# EAGLE design TestBoard1 (EAGLE 7.1.0)
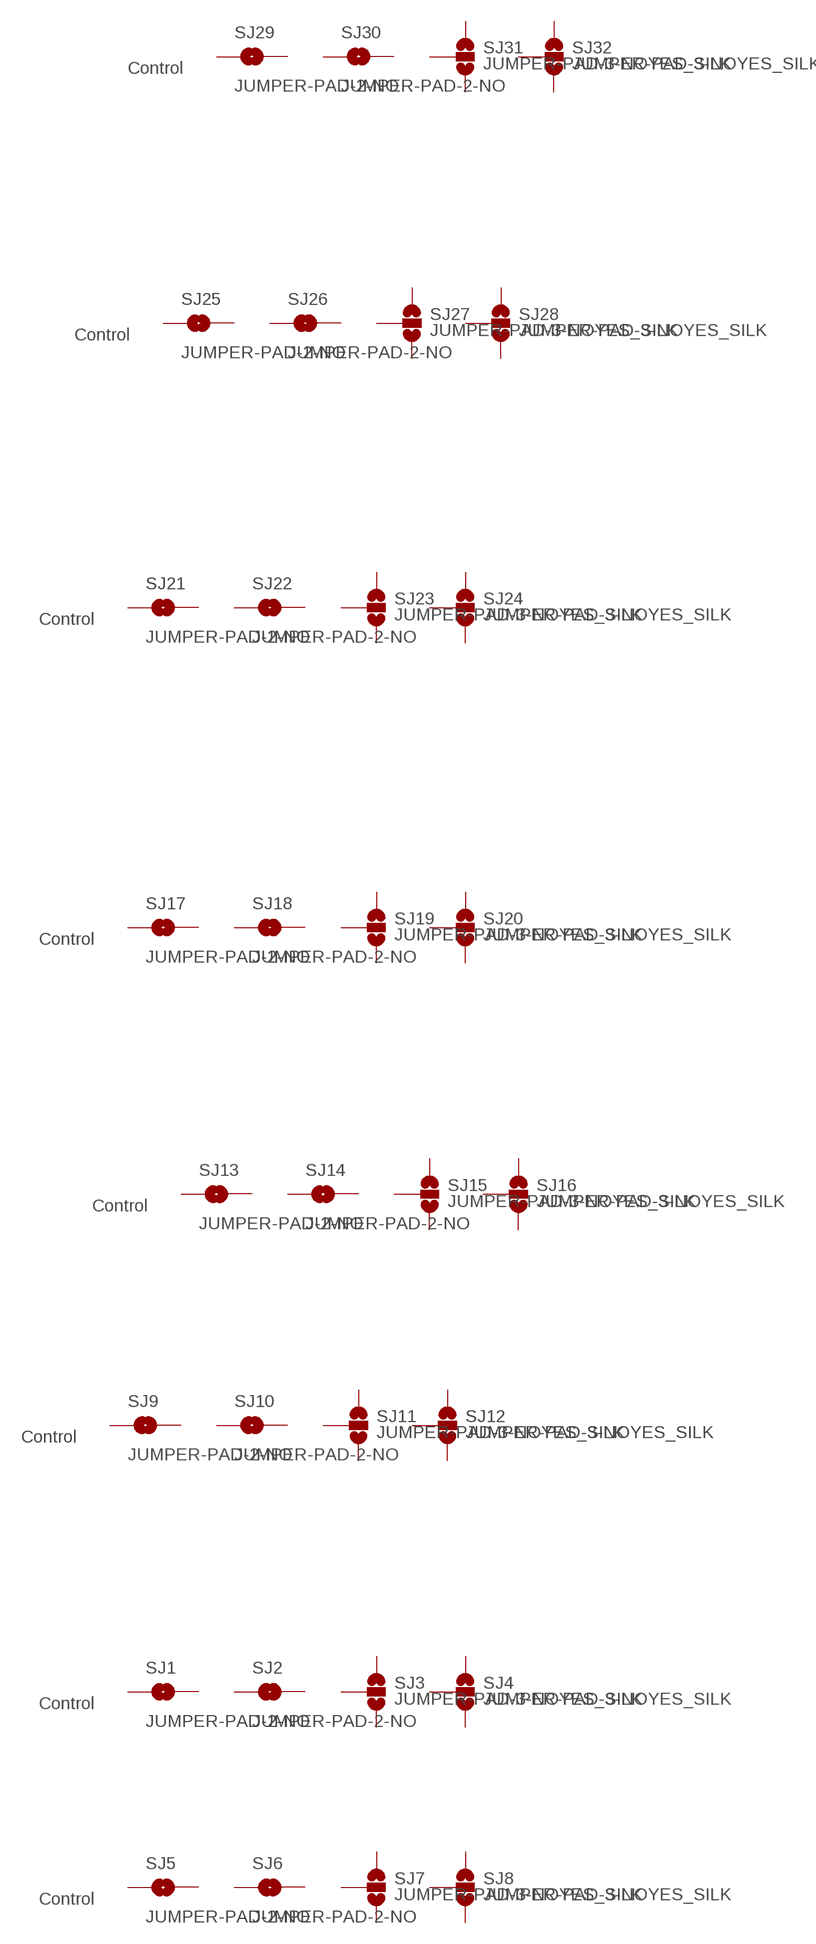
[diagram p0: schematic, sheet 1]

## Parts
SJ1  JUMPER-PAD-2-NO  [PAD-JUMPER-2-NO_NO_SILK]
SJ2  JUMPER-PAD-2-NO  [PAD-JUMPER-2-NO_NO_SILK]
SJ3  JUMPER-PAD-3-NOYES_SILK  [PAD-JUMPER-3-NO_YES_SILK]
SJ4  JUMPER-PAD-3-NOYES_SILK  [PAD-JUMPER-3-NO_YES_SILK]
SJ5  JUMPER-PAD-2-NO  [PAD-JUMPER-2-NO_NO_SILK]
SJ6  JUMPER-PAD-2-NO  [PAD-JUMPER-2-NO_NO_SILK]
SJ7  JUMPER-PAD-3-NOYES_SILK  [PAD-JUMPER-3-NO_YES_SILK]
SJ8  JUMPER-PAD-3-NOYES_SILK  [PAD-JUMPER-3-NO_YES_SILK]
SJ9  JUMPER-PAD-2-NO  [PAD-JUMPER-2-NO_NO_SILK]
SJ10  JUMPER-PAD-2-NO  [PAD-JUMPER-2-NO_NO_SILK]
SJ11  JUMPER-PAD-3-NOYES_SILK  [PAD-JUMPER-3-NO_YES_SILK]
SJ12  JUMPER-PAD-3-NOYES_SILK  [PAD-JUMPER-3-NO_YES_SILK]
SJ13  JUMPER-PAD-2-NO  [PAD-JUMPER-2-NO_NO_SILK]
SJ14  JUMPER-PAD-2-NO  [PAD-JUMPER-2-NO_NO_SILK]
SJ15  JUMPER-PAD-3-NOYES_SILK  [PAD-JUMPER-3-NO_YES_SILK]
SJ16  JUMPER-PAD-3-NOYES_SILK  [PAD-JUMPER-3-NO_YES_SILK]
SJ17  JUMPER-PAD-2-NO  [PAD-JUMPER-2-NO_NO_SILK]
SJ18  JUMPER-PAD-2-NO  [PAD-JUMPER-2-NO_NO_SILK]
SJ19  JUMPER-PAD-3-NOYES_SILK  [PAD-JUMPER-3-NO_YES_SILK]
SJ20  JUMPER-PAD-3-NOYES_SILK  [PAD-JUMPER-3-NO_YES_SILK]
SJ21  JUMPER-PAD-2-NO  [PAD-JUMPER-2-NO_NO_SILK]
SJ22  JUMPER-PAD-2-NO  [PAD-JUMPER-2-NO_NO_SILK]
SJ23  JUMPER-PAD-3-NOYES_SILK  [PAD-JUMPER-3-NO_YES_SILK]
SJ24  JUMPER-PAD-3-NOYES_SILK  [PAD-JUMPER-3-NO_YES_SILK]
SJ25  JUMPER-PAD-2-NO  [PAD-JUMPER-2-NO_NO_SILK]
SJ26  JUMPER-PAD-2-NO  [PAD-JUMPER-2-NO_NO_SILK]
SJ27  JUMPER-PAD-3-NOYES_SILK  [PAD-JUMPER-3-NO_YES_SILK]
SJ28  JUMPER-PAD-3-NOYES_SILK  [PAD-JUMPER-3-NO_YES_SILK]
SJ29  JUMPER-PAD-2-NO  [PAD-JUMPER-2-NO_NO_SILK]
SJ30  JUMPER-PAD-2-NO  [PAD-JUMPER-2-NO_NO_SILK]
SJ31  JUMPER-PAD-3-NOYES_SILK  [PAD-JUMPER-3-NO_YES_SILK]
SJ32  JUMPER-PAD-3-NOYES_SILK  [PAD-JUMPER-3-NO_YES_SILK]
Unconnected: SJ1.1 SJ1.2 SJ2.1 SJ2.2 SJ3.1 SJ3.2 SJ3.3 SJ4.1 SJ4.2 SJ4.3 SJ5.1 SJ5.2 SJ6.1 SJ6.2 SJ7.1 SJ7.2 SJ7.3 SJ8.1 SJ8.2 SJ8.3 SJ9.1 SJ9.2 SJ10.1 SJ10.2 SJ11.1 SJ11.2 SJ11.3 SJ12.1 SJ12.2 SJ12.3 SJ13.1 SJ13.2 SJ14.1 SJ14.2 SJ15.1 SJ15.2 SJ15.3 SJ16.1 SJ16.2 SJ16.3 SJ17.1 SJ17.2 SJ18.1 SJ18.2 SJ19.1 SJ19.2 SJ19.3 SJ20.1 SJ20.2 SJ20.3 SJ21.1 SJ21.2 SJ22.1 SJ22.2 SJ23.1 SJ23.2 SJ23.3 SJ24.1 SJ24.2 SJ24.3 SJ25.1 SJ25.2 SJ26.1 SJ26.2 SJ27.1 SJ27.2 SJ27.3 SJ28.1 SJ28.2 SJ28.3 SJ29.1 SJ29.2 SJ30.1 SJ30.2 SJ31.1 SJ31.2 SJ31.3 SJ32.1 SJ32.2 SJ32.3

## Notes on the sheet
- Control
- Control
- Control
- Control
- Control
- Control
- Control
- Control

## Library data of the parts
SJ1 SJ2 SJ5 SJ6 SJ9 SJ10 SJ13 SJ14 SJ17 SJ18 SJ21 SJ22 SJ25 SJ26 SJ29 SJ30 = TestAperatures:JUMPER-PAD-2-NO
SJ3 SJ4 SJ7 SJ8 SJ11 SJ12 SJ15 SJ16 SJ19 SJ20 SJ23 SJ24 SJ27 SJ28 SJ31 SJ32 = TestAperatures:JUMPER-PAD-3-NO

## Board
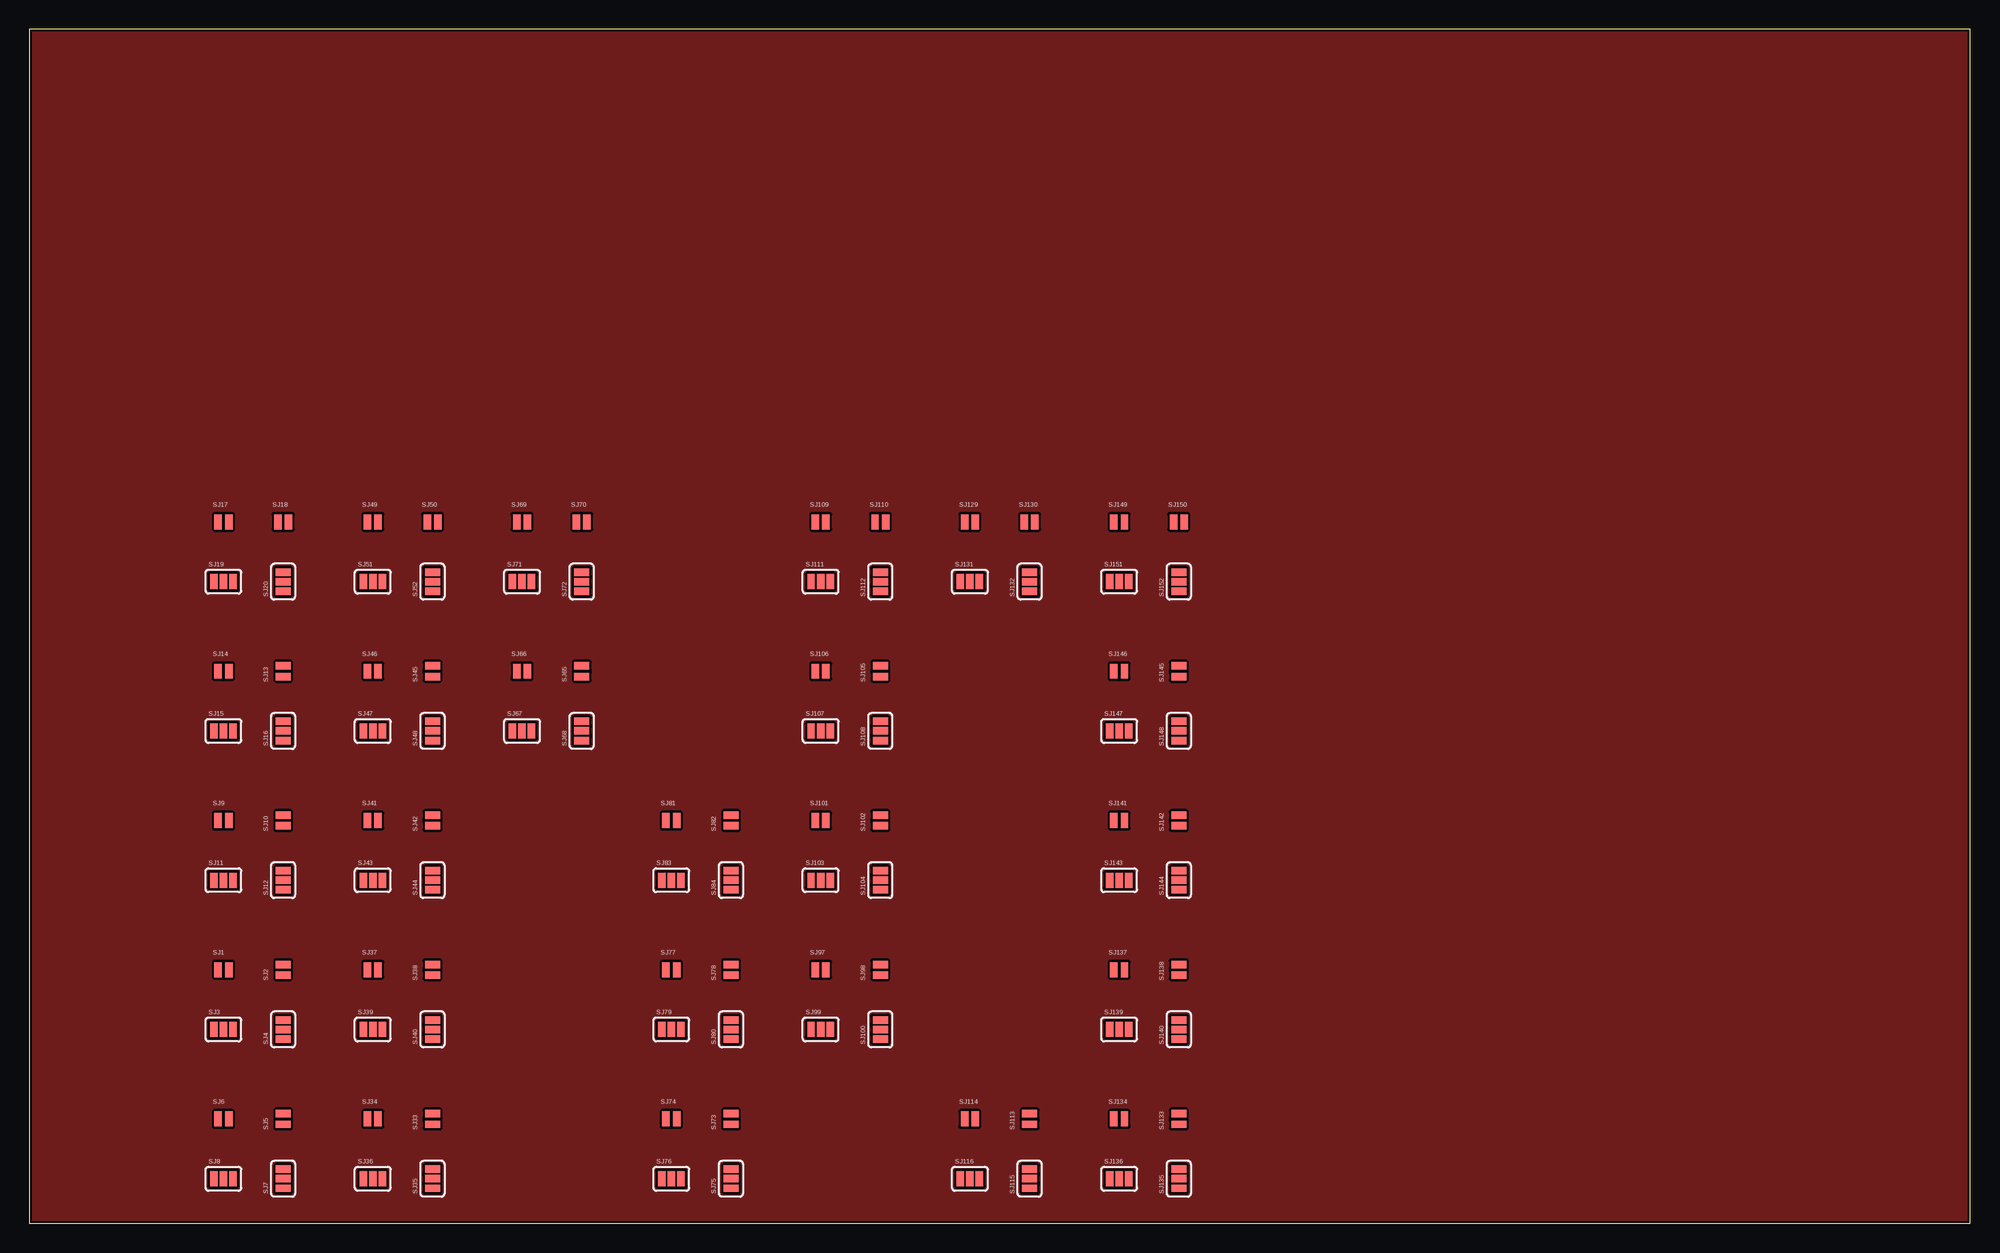
[diagram p1: board, top side]

Size 165.1 x 101.6 mm. Coordinates in mm from the lower left corner, seen from the top.
Outline: 0,0 165.1,0 165.1,101.6 0,101.6 0,0
Copper layers (1*16): Top 0.035mm / dielectric 1.5mm / Bottom 0.035mm
Design rules "SparkFun-2-layer": minimum track width 7mil, minimum drill 15mil, track to track 8mil, track to pad 8mil, pad to pad 8mil, via to via 8mil, smd to smd 8mil, copper to edge 8mil, drill to drill 8mil, minimum pad ring 12mil, minimum via ring 10mil, stop-mask expansion 4mil, vias tented up to drill 20mil, thermal gap 10mil

### Footprints (pad centres in the part's own frame; a part is rotated, then mirrored left to right if it is on the bottom)
PAD-JUMPER-2-NO_NO_SILK = smd 0.635 x 1.27: 1 -0.45,0; 2 0.45,0
PAD-JUMPER-3-NO_YES_SILK = smd 0.635 x 1.27: 1 -0.813,0; 2 0,0; 3 0.813,0

### Placement (x,y rotation side)
SJ1  16.51,21.59 0 top
SJ2  21.59,21.59 90 top
SJ3  16.51,16.51 0 top
SJ4  21.59,16.51 90 top
SJ5  21.59,8.89 90 top
SJ6  16.51,8.89 0 top
SJ7  21.59,3.81 90 top
SJ8  16.51,3.81 0 top
SJ9  16.51,34.29 0 top
SJ10  21.59,34.29 90 top
SJ11  16.51,29.21 0 top
SJ12  21.59,29.21 90 top
SJ13  21.59,46.99 90 top
SJ14  16.51,46.99 0 top
SJ15  16.51,41.91 0 top
SJ16  21.59,41.91 90 top
SJ17  16.51,59.69 0 top
SJ18  21.59,59.69 0 top
SJ19  16.51,54.61 0 top
SJ20  21.59,54.61 90 top
SJ21  12.7,-38.1 0 top  (outside the outline)
SJ22  25.4,-38.1 0 top  (outside the outline)
SJ23  -12.7,-12.7 0 top  (outside the outline)
SJ24  0,-12.7 0 top  (outside the outline)
SJ25  38.1,-38.1 0 top  (outside the outline)
SJ26  -12.7,-50.8 0 top  (outside the outline)
SJ27  12.7,-12.7 0 top  (outside the outline)
SJ28  25.4,-12.7 0 top  (outside the outline)
SJ29  0,-50.8 0 top  (outside the outline)
SJ30  12.7,-50.8 0 top  (outside the outline)
SJ31  -12.7,-25.4 0 top  (outside the outline)
SJ32  0,-25.4 0 top  (outside the outline)
SJ33  JUMPER-PAD-2-NO  [PAD-JUMPER-2-NO_NO_SILK]  34.29,8.89 90 top
SJ34  JUMPER-PAD-2-NO  [PAD-JUMPER-2-NO_NO_SILK]  29.21,8.89 0 top
SJ35  JUMPER-PAD-3-NOYES_SILK  [PAD-JUMPER-3-NO_YES_SILK]  34.29,3.81 90 top
SJ36  JUMPER-PAD-3-NOYES_SILK  [PAD-JUMPER-3-NO_YES_SILK]  29.21,3.81 0 top
SJ37  JUMPER-PAD-2-NO  [PAD-JUMPER-2-NO_NO_SILK]  29.21,21.59 0 top
SJ38  JUMPER-PAD-2-NO  [PAD-JUMPER-2-NO_NO_SILK]  34.29,21.59 90 top
SJ39  JUMPER-PAD-3-NOYES_SILK  [PAD-JUMPER-3-NO_YES_SILK]  29.21,16.51 0 top
SJ40  JUMPER-PAD-3-NOYES_SILK  [PAD-JUMPER-3-NO_YES_SILK]  34.29,16.51 90 top
SJ41  JUMPER-PAD-2-NO  [PAD-JUMPER-2-NO_NO_SILK]  29.21,34.29 0 top
SJ42  JUMPER-PAD-2-NO  [PAD-JUMPER-2-NO_NO_SILK]  34.29,34.29 90 top
SJ43  JUMPER-PAD-3-NOYES_SILK  [PAD-JUMPER-3-NO_YES_SILK]  29.21,29.21 0 top
SJ44  JUMPER-PAD-3-NOYES_SILK  [PAD-JUMPER-3-NO_YES_SILK]  34.29,29.21 90 top
SJ45  JUMPER-PAD-2-NO  [PAD-JUMPER-2-NO_NO_SILK]  34.29,46.99 90 top
SJ46  JUMPER-PAD-2-NO  [PAD-JUMPER-2-NO_NO_SILK]  29.21,46.99 0 top
SJ47  JUMPER-PAD-3-NOYES_SILK  [PAD-JUMPER-3-NO_YES_SILK]  29.21,41.91 0 top
SJ48  JUMPER-PAD-3-NOYES_SILK  [PAD-JUMPER-3-NO_YES_SILK]  34.29,41.91 90 top
SJ49  JUMPER-PAD-2-NO  [PAD-JUMPER-2-NO_NO_SILK]  29.21,59.69 0 top
SJ50  JUMPER-PAD-2-NO  [PAD-JUMPER-2-NO_NO_SILK]  34.29,59.69 0 top
SJ51  JUMPER-PAD-3-NOYES_SILK  [PAD-JUMPER-3-NO_YES_SILK]  29.21,54.61 0 top
SJ52  JUMPER-PAD-3-NOYES_SILK  [PAD-JUMPER-3-NO_YES_SILK]  34.29,54.61 90 top
SJ53  JUMPER-PAD-2-NO  [PAD-JUMPER-2-NO_NO_SILK]  25.4,-50.8 0 top  (outside the outline)
SJ54  JUMPER-PAD-2-NO  [PAD-JUMPER-2-NO_NO_SILK]  38.1,-50.8 0 top  (outside the outline)
SJ55  JUMPER-PAD-3-NOYES_SILK  [PAD-JUMPER-3-NO_YES_SILK]  12.7,-25.4 0 top  (outside the outline)
SJ56  JUMPER-PAD-3-NOYES_SILK  [PAD-JUMPER-3-NO_YES_SILK]  25.4,-25.4 0 top  (outside the outline)
SJ57  JUMPER-PAD-2-NO  [PAD-JUMPER-2-NO_NO_SILK]  -12.7,-63.5 0 top  (outside the outline)
SJ58  JUMPER-PAD-2-NO  [PAD-JUMPER-2-NO_NO_SILK]  0,-63.5 0 top  (outside the outline)
SJ59  JUMPER-PAD-3-NOYES_SILK  [PAD-JUMPER-3-NO_YES_SILK]  -12.7,-38.1 0 top  (outside the outline)
SJ60  JUMPER-PAD-3-NOYES_SILK  [PAD-JUMPER-3-NO_YES_SILK]  0,-38.1 0 top  (outside the outline)
SJ61  JUMPER-PAD-2-NO  [PAD-JUMPER-2-NO_NO_SILK]  12.7,-101.6 0 top  (outside the outline)
SJ62  JUMPER-PAD-2-NO  [PAD-JUMPER-2-NO_NO_SILK]  25.4,-101.6 0 top  (outside the outline)
SJ63  JUMPER-PAD-3-NOYES_SILK  [PAD-JUMPER-3-NO_YES_SILK]  -12.7,-76.2 0 top  (outside the outline)
SJ64  JUMPER-PAD-3-NOYES_SILK  [PAD-JUMPER-3-NO_YES_SILK]  0,-76.2 0 top  (outside the outline)
SJ65  JUMPER-PAD-2-NO  [PAD-JUMPER-2-NO_NO_SILK]  46.99,46.99 90 top
SJ66  JUMPER-PAD-2-NO  [PAD-JUMPER-2-NO_NO_SILK]  41.91,46.99 0 top
SJ67  JUMPER-PAD-3-NOYES_SILK  [PAD-JUMPER-3-NO_YES_SILK]  41.91,41.91 0 top
SJ68  JUMPER-PAD-3-NOYES_SILK  [PAD-JUMPER-3-NO_YES_SILK]  46.99,41.91 90 top
SJ69  JUMPER-PAD-2-NO  [PAD-JUMPER-2-NO_NO_SILK]  41.91,59.69 0 top
SJ70  JUMPER-PAD-2-NO  [PAD-JUMPER-2-NO_NO_SILK]  46.99,59.69 0 top
SJ71  JUMPER-PAD-3-NOYES_SILK  [PAD-JUMPER-3-NO_YES_SILK]  41.91,54.61 0 top
SJ72  JUMPER-PAD-3-NOYES_SILK  [PAD-JUMPER-3-NO_YES_SILK]  46.99,54.61 90 top
SJ73  JUMPER-PAD-2-NO  [PAD-JUMPER-2-NO_NO_SILK]  59.69,8.89 90 top
SJ74  JUMPER-PAD-2-NO  [PAD-JUMPER-2-NO_NO_SILK]  54.61,8.89 0 top
SJ75  JUMPER-PAD-3-NOYES_SILK  [PAD-JUMPER-3-NO_YES_SILK]  59.69,3.81 90 top
SJ76  JUMPER-PAD-3-NOYES_SILK  [PAD-JUMPER-3-NO_YES_SILK]  54.61,3.81 0 top
SJ77  JUMPER-PAD-2-NO  [PAD-JUMPER-2-NO_NO_SILK]  54.61,21.59 0 top
SJ78  JUMPER-PAD-2-NO  [PAD-JUMPER-2-NO_NO_SILK]  59.69,21.59 90 top
SJ79  JUMPER-PAD-3-NOYES_SILK  [PAD-JUMPER-3-NO_YES_SILK]  54.61,16.51 0 top
SJ80  JUMPER-PAD-3-NOYES_SILK  [PAD-JUMPER-3-NO_YES_SILK]  59.69,16.51 90 top
SJ81  JUMPER-PAD-2-NO  [PAD-JUMPER-2-NO_NO_SILK]  54.61,34.29 0 top
SJ82  JUMPER-PAD-2-NO  [PAD-JUMPER-2-NO_NO_SILK]  59.69,34.29 90 top
SJ83  JUMPER-PAD-3-NOYES_SILK  [PAD-JUMPER-3-NO_YES_SILK]  54.61,29.21 0 top
SJ84  JUMPER-PAD-3-NOYES_SILK  [PAD-JUMPER-3-NO_YES_SILK]  59.69,29.21 90 top
SJ85  JUMPER-PAD-2-NO  [PAD-JUMPER-2-NO_NO_SILK]  38.1,-101.6 0 top  (outside the outline)
SJ86  JUMPER-PAD-2-NO  [PAD-JUMPER-2-NO_NO_SILK]  -12.7,-114.3 0 top  (outside the outline)
SJ87  JUMPER-PAD-3-NOYES_SILK  [PAD-JUMPER-3-NO_YES_SILK]  12.7,-76.2 0 top  (outside the outline)
SJ88  JUMPER-PAD-3-NOYES_SILK  [PAD-JUMPER-3-NO_YES_SILK]  25.4,-76.2 0 top  (outside the outline)
SJ89  JUMPER-PAD-2-NO  [PAD-JUMPER-2-NO_NO_SILK]  0,-114.3 0 top  (outside the outline)
SJ90  JUMPER-PAD-2-NO  [PAD-JUMPER-2-NO_NO_SILK]  12.7,-114.3 0 top  (outside the outline)
SJ91  JUMPER-PAD-3-NOYES_SILK  [PAD-JUMPER-3-NO_YES_SILK]  -12.7,-88.9 0 top  (outside the outline)
SJ92  JUMPER-PAD-3-NOYES_SILK  [PAD-JUMPER-3-NO_YES_SILK]  0,-88.9 0 top  (outside the outline)
SJ93  JUMPER-PAD-2-NO  [PAD-JUMPER-2-NO_NO_SILK]  25.4,-114.3 0 top  (outside the outline)
SJ94  JUMPER-PAD-2-NO  [PAD-JUMPER-2-NO_NO_SILK]  38.1,-114.3 0 top  (outside the outline)
SJ95  JUMPER-PAD-3-NOYES_SILK  [PAD-JUMPER-3-NO_YES_SILK]  12.7,-88.9 0 top  (outside the outline)
SJ96  JUMPER-PAD-3-NOYES_SILK  [PAD-JUMPER-3-NO_YES_SILK]  25.4,-88.9 0 top  (outside the outline)
SJ97  JUMPER-PAD-2-NO  [PAD-JUMPER-2-NO_NO_SILK]  67.31,21.59 0 top
SJ98  JUMPER-PAD-2-NO  [PAD-JUMPER-2-NO_NO_SILK]  72.39,21.59 90 top
SJ99  JUMPER-PAD-3-NOYES_SILK  [PAD-JUMPER-3-NO_YES_SILK]  67.31,16.51 0 top
SJ100  JUMPER-PAD-3-NOYES_SILK  [PAD-JUMPER-3-NO_YES_SILK]  72.39,16.51 90 top
SJ101  JUMPER-PAD-2-NO  [PAD-JUMPER-2-NO_NO_SILK]  67.31,34.29 0 top
SJ102  JUMPER-PAD-2-NO  [PAD-JUMPER-2-NO_NO_SILK]  72.39,34.29 90 top
SJ103  JUMPER-PAD-3-NOYES_SILK  [PAD-JUMPER-3-NO_YES_SILK]  67.31,29.21 0 top
SJ104  JUMPER-PAD-3-NOYES_SILK  [PAD-JUMPER-3-NO_YES_SILK]  72.39,29.21 90 top
SJ105  JUMPER-PAD-2-NO  [PAD-JUMPER-2-NO_NO_SILK]  72.39,46.99 90 top
SJ106  JUMPER-PAD-2-NO  [PAD-JUMPER-2-NO_NO_SILK]  67.31,46.99 0 top
SJ107  JUMPER-PAD-3-NOYES_SILK  [PAD-JUMPER-3-NO_YES_SILK]  67.31,41.91 0 top
SJ108  JUMPER-PAD-3-NOYES_SILK  [PAD-JUMPER-3-NO_YES_SILK]  72.39,41.91 90 top
SJ109  JUMPER-PAD-2-NO  [PAD-JUMPER-2-NO_NO_SILK]  67.31,59.69 0 top
SJ110  JUMPER-PAD-2-NO  [PAD-JUMPER-2-NO_NO_SILK]  72.39,59.69 0 top
SJ111  JUMPER-PAD-3-NOYES_SILK  [PAD-JUMPER-3-NO_YES_SILK]  67.31,54.61 0 top
SJ112  JUMPER-PAD-3-NOYES_SILK  [PAD-JUMPER-3-NO_YES_SILK]  72.39,54.61 90 top
SJ113  JUMPER-PAD-2-NO  [PAD-JUMPER-2-NO_NO_SILK]  85.09,8.89 90 top
SJ114  JUMPER-PAD-2-NO  [PAD-JUMPER-2-NO_NO_SILK]  80.01,8.89 0 top
SJ115  JUMPER-PAD-3-NOYES_SILK  [PAD-JUMPER-3-NO_YES_SILK]  85.09,3.81 90 top
SJ116  JUMPER-PAD-3-NOYES_SILK  [PAD-JUMPER-3-NO_YES_SILK]  80.01,3.81 0 top
SJ117  JUMPER-PAD-2-NO  [PAD-JUMPER-2-NO_NO_SILK]  -12.7,-127 0 top  (outside the outline)
SJ118  JUMPER-PAD-2-NO  [PAD-JUMPER-2-NO_NO_SILK]  0,-127 0 top  (outside the outline)
SJ119  JUMPER-PAD-3-NOYES_SILK  [PAD-JUMPER-3-NO_YES_SILK]  -12.7,-101.6 0 top  (outside the outline)
SJ120  JUMPER-PAD-3-NOYES_SILK  [PAD-JUMPER-3-NO_YES_SILK]  0,-101.6 0 top  (outside the outline)
SJ121  JUMPER-PAD-2-NO  [PAD-JUMPER-2-NO_NO_SILK]  12.7,-165.1 0 top  (outside the outline)
SJ122  JUMPER-PAD-2-NO  [PAD-JUMPER-2-NO_NO_SILK]  25.4,-165.1 0 top  (outside the outline)
SJ123  JUMPER-PAD-3-NOYES_SILK  [PAD-JUMPER-3-NO_YES_SILK]  -12.7,-139.7 0 top  (outside the outline)
SJ124  JUMPER-PAD-3-NOYES_SILK  [PAD-JUMPER-3-NO_YES_SILK]  0,-139.7 0 top  (outside the outline)
SJ125  JUMPER-PAD-2-NO  [PAD-JUMPER-2-NO_NO_SILK]  38.1,-165.1 0 top  (outside the outline)
SJ126  JUMPER-PAD-2-NO  [PAD-JUMPER-2-NO_NO_SILK]  -12.7,-177.8 0 top  (outside the outline)
SJ127  JUMPER-PAD-3-NOYES_SILK  [PAD-JUMPER-3-NO_YES_SILK]  12.7,-139.7 0 top  (outside the outline)
SJ128  JUMPER-PAD-3-NOYES_SILK  [PAD-JUMPER-3-NO_YES_SILK]  25.4,-139.7 0 top  (outside the outline)
SJ129  JUMPER-PAD-2-NO  [PAD-JUMPER-2-NO_NO_SILK]  80.01,59.69 0 top
SJ130  JUMPER-PAD-2-NO  [PAD-JUMPER-2-NO_NO_SILK]  85.09,59.69 0 top
SJ131  JUMPER-PAD-3-NOYES_SILK  [PAD-JUMPER-3-NO_YES_SILK]  80.01,54.61 0 top
SJ132  JUMPER-PAD-3-NOYES_SILK  [PAD-JUMPER-3-NO_YES_SILK]  85.09,54.61 90 top
SJ133  JUMPER-PAD-2-NO  [PAD-JUMPER-2-NO_NO_SILK]  97.79,8.89 90 top
SJ134  JUMPER-PAD-2-NO  [PAD-JUMPER-2-NO_NO_SILK]  92.71,8.89 0 top
SJ135  JUMPER-PAD-3-NOYES_SILK  [PAD-JUMPER-3-NO_YES_SILK]  97.79,3.81 90 top
SJ136  JUMPER-PAD-3-NOYES_SILK  [PAD-JUMPER-3-NO_YES_SILK]  92.71,3.81 0 top
SJ137  JUMPER-PAD-2-NO  [PAD-JUMPER-2-NO_NO_SILK]  92.71,21.59 0 top
SJ138  JUMPER-PAD-2-NO  [PAD-JUMPER-2-NO_NO_SILK]  97.79,21.59 90 top
SJ139  JUMPER-PAD-3-NOYES_SILK  [PAD-JUMPER-3-NO_YES_SILK]  92.71,16.51 0 top
SJ140  JUMPER-PAD-3-NOYES_SILK  [PAD-JUMPER-3-NO_YES_SILK]  97.79,16.51 90 top
SJ141  JUMPER-PAD-2-NO  [PAD-JUMPER-2-NO_NO_SILK]  92.71,34.29 0 top
SJ142  JUMPER-PAD-2-NO  [PAD-JUMPER-2-NO_NO_SILK]  97.79,34.29 90 top
SJ143  JUMPER-PAD-3-NOYES_SILK  [PAD-JUMPER-3-NO_YES_SILK]  92.71,29.21 0 top
SJ144  JUMPER-PAD-3-NOYES_SILK  [PAD-JUMPER-3-NO_YES_SILK]  97.79,29.21 90 top
SJ145  JUMPER-PAD-2-NO  [PAD-JUMPER-2-NO_NO_SILK]  97.79,46.99 90 top
SJ146  JUMPER-PAD-2-NO  [PAD-JUMPER-2-NO_NO_SILK]  92.71,46.99 0 top
SJ147  JUMPER-PAD-3-NOYES_SILK  [PAD-JUMPER-3-NO_YES_SILK]  92.71,41.91 0 top
SJ148  JUMPER-PAD-3-NOYES_SILK  [PAD-JUMPER-3-NO_YES_SILK]  97.79,41.91 90 top
SJ149  JUMPER-PAD-2-NO  [PAD-JUMPER-2-NO_NO_SILK]  92.71,59.69 0 top
SJ150  JUMPER-PAD-2-NO  [PAD-JUMPER-2-NO_NO_SILK]  97.79,59.69 0 top
SJ151  JUMPER-PAD-3-NOYES_SILK  [PAD-JUMPER-3-NO_YES_SILK]  92.71,54.61 0 top
SJ152  JUMPER-PAD-3-NOYES_SILK  [PAD-JUMPER-3-NO_YES_SILK]  97.79,54.61 90 top
SJ153  JUMPER-PAD-2-NO  [PAD-JUMPER-2-NO_NO_SILK]  0,-177.8 0 top  (outside the outline)
SJ154  JUMPER-PAD-2-NO  [PAD-JUMPER-2-NO_NO_SILK]  12.7,-177.8 0 top  (outside the outline)
SJ155  JUMPER-PAD-3-NOYES_SILK  [PAD-JUMPER-3-NO_YES_SILK]  -12.7,-152.4 0 top  (outside the outline)
SJ156  JUMPER-PAD-3-NOYES_SILK  [PAD-JUMPER-3-NO_YES_SILK]  0,-152.4 0 top  (outside the outline)
SJ157  JUMPER-PAD-2-NO  [PAD-JUMPER-2-NO_NO_SILK]  25.4,-177.8 0 top  (outside the outline)
SJ158  JUMPER-PAD-2-NO  [PAD-JUMPER-2-NO_NO_SILK]  38.1,-177.8 0 top  (outside the outline)
SJ159  JUMPER-PAD-3-NOYES_SILK  [PAD-JUMPER-3-NO_YES_SILK]  12.7,-152.4 0 top  (outside the outline)
SJ160  JUMPER-PAD-3-NOYES_SILK  [PAD-JUMPER-3-NO_YES_SILK]  25.4,-152.4 0 top  (outside the outline)
SJ161  JUMPER-PAD-2-NO  [PAD-JUMPER-2-NO_NO_SILK]  -12.7,-190.5 0 top  (outside the outline)
SJ162  JUMPER-PAD-2-NO  [PAD-JUMPER-2-NO_NO_SILK]  0,-190.5 0 top  (outside the outline)
SJ163  JUMPER-PAD-3-NOYES_SILK  [PAD-JUMPER-3-NO_YES_SILK]  -12.7,-165.1 0 top  (outside the outline)
SJ164  JUMPER-PAD-3-NOYES_SILK  [PAD-JUMPER-3-NO_YES_SILK]  0,-165.1 0 top  (outside the outline)

### Tracks (layer width: path | path; a pad name or v marks a point on that pad's centre or on a via)
GND
  pour Top: 0,101.6 165.1,101.6 165.1,0 0,0

### Text on the board
Reference: 70% | 60% | 50% | 40% | 30% | 20% | 10% | Control